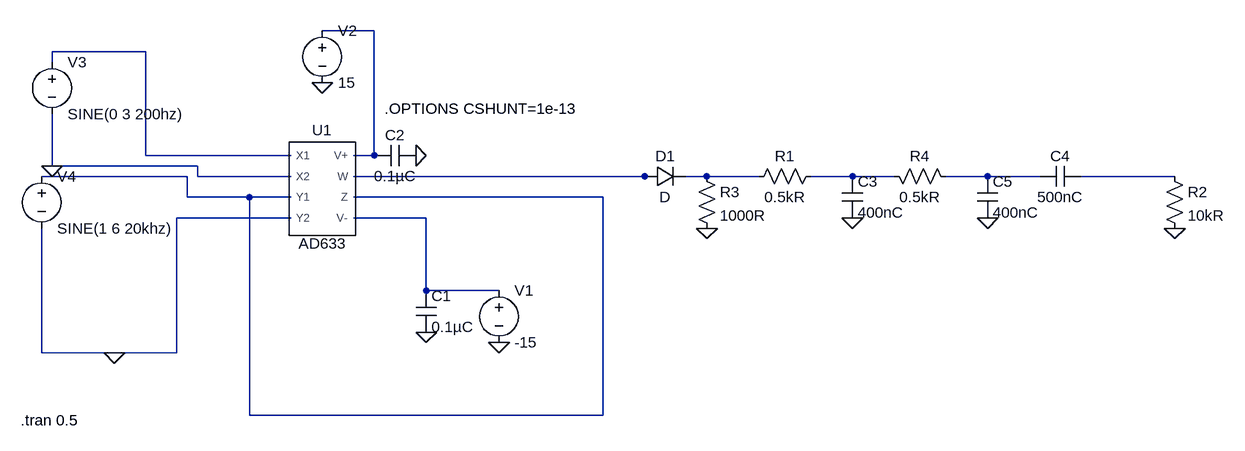
[diagram p0: schematic PTEC Opdracht 1.asc]
PTEC Opdracht 1.asc, the LTspice schematic file:
Version 4
SHEET 1 1576 680
WIRE -96 -176 -176 -176
WIRE -448 -144 -592 -144
WIRE -592 -128 -592 -144
WIRE -448 16 -448 -144
WIRE -224 16 -448 16
WIRE -96 16 -96 -176
WIRE -96 16 -128 16
WIRE -592 32 -592 -48
WIRE -368 32 -592 32
WIRE -384 48 -608 48
WIRE -368 48 -368 32
WIRE -224 48 -368 48
WIRE 320 48 -128 48
WIRE 336 48 320 48
WIRE 416 48 384 48
WIRE 496 48 416 48
WIRE 640 48 576 48
WIRE 704 48 640 48
WIRE 848 48 784 48
WIRE 928 48 848 48
WIRE 1136 48 992 48
WIRE -384 80 -384 48
WIRE -288 80 -384 80
WIRE -224 80 -288 80
WIRE 256 80 -128 80
WIRE -224 112 -400 112
WIRE -16 112 -128 112
WIRE -16 224 -16 112
WIRE 96 224 -16 224
WIRE -608 320 -608 128
WIRE -496 320 -608 320
WIRE -400 320 -400 112
WIRE -400 320 -496 320
WIRE -288 416 -288 80
WIRE 256 416 256 80
WIRE 256 416 -288 416
FLAG 96 304 0
FLAG -16 288 0
FLAG -176 -96 0
FLAG -32 16 0
FLAG -496 320 0
FLAG -592 32 0
FLAG 640 112 0
FLAG 1136 128 0
FLAG 416 128 0
FLAG 848 112 0
SYMBOL AD633 -176 64 R0
SYMATTR InstName U1
SYMBOL voltage 96 208 R0
WINDOW 123 0 0 Left 2
WINDOW 39 0 0 Left 2
SYMATTR InstName V1
SYMATTR Value -15
SYMBOL cap -32 224 R0
SYMATTR InstName C1
SYMATTR Value 0.1µC
SYMBOL voltage -176 -192 R0
WINDOW 123 0 0 Left 2
WINDOW 39 0 0 Left 2
SYMATTR InstName V2
SYMATTR Value 15
SYMBOL cap -96 32 R270
WINDOW 0 32 32 VTop 2
WINDOW 3 0 32 VBottom 2
SYMATTR InstName C2
SYMATTR Value 0.1µC
SYMBOL voltage -592 -144 R0
WINDOW 123 0 0 Left 2
WINDOW 39 0 0 Left 2
SYMATTR InstName V3
SYMATTR Value SINE(0 3 200hz)
SYMBOL voltage -608 32 R0
WINDOW 123 0 0 Left 2
WINDOW 39 0 0 Left 2
SYMATTR InstName V4
SYMATTR Value SINE(1 6 20khz)
SYMBOL diode 320 64 R270
WINDOW 0 32 32 VTop 2
WINDOW 3 0 32 VBottom 2
SYMATTR InstName D1
SYMBOL res 592 32 R90
WINDOW 0 0 56 VBottom 2
WINDOW 3 32 56 VTop 2
SYMATTR InstName R1
SYMATTR Value 0.5kR
SYMBOL cap 624 48 R0
SYMATTR InstName C3
SYMATTR Value 400nC
SYMBOL res 1120 32 R0
SYMATTR InstName R2
SYMATTR Value 10kR
SYMBOL res 400 32 R0
SYMATTR InstName R3
SYMATTR Value 1000R
SYMBOL cap 992 32 R90
WINDOW 0 0 32 VBottom 2
WINDOW 3 32 32 VTop 2
SYMATTR InstName C4
SYMATTR Value 500nC
SYMBOL res 688 32 M90
WINDOW 0 0 56 VBottom 2
WINDOW 3 32 56 VTop 2
SYMATTR InstName R4
SYMATTR Value 0.5kR
SYMBOL cap 832 48 R0
SYMATTR InstName C5
SYMATTR Value 400nC
TEXT -80 -56 Left 2 !.OPTIONS CSHUNT=1e-13
TEXT -640 424 Left 2 !.tran 0.5

The netlist it stands for:
* PTEC Opdracht 1.asc
XU1 N002 0 N003 0 N009 N003 N004 N001 AD633  ; pins X1 X2 Y1 Y2 V- Z W V+
V1 N009 0 -15
C1 N009 0 0.1µC
V2 N001 0 15
C2 N001 0 0.1µC
V3 N002 0 SINE(0 3 200hz)
V4 N003 0 SINE(1 6 20khz)
D1 N004 N005 D
R1 N006 N005 0.5kR
C3 N006 0 400nC
R2 N008 0 10kR
R3 N005 0 1000R
C4 N008 N007 500nC
R4 N006 N007 0.5kR
C5 N007 0 400nC
.model D D
.lib standard.dio
.OPTIONS CSHUNT=1e-13
.tran 0.5
.lib ad633.cir
.backanno
.end